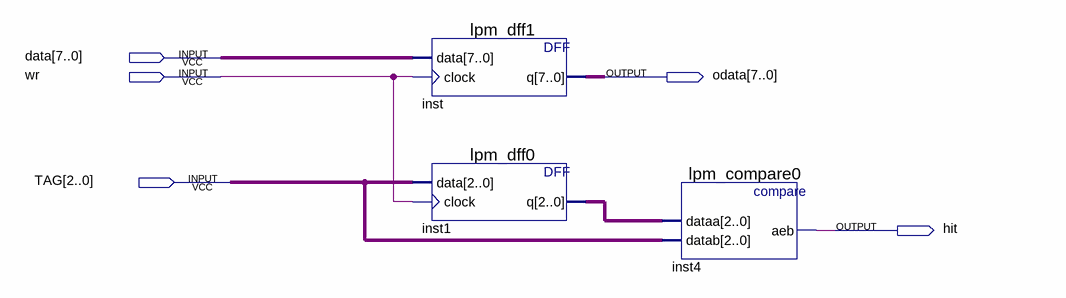
[diagram p0: schematic sheet]
// Quartus schematic cache_cell.bdf as structural Verilog: 3 symbols, 5 pins
module cache_cell (
  input  [7:0] data,
  input  wr,
  input  [2:0] TAG,
  output [7:0] odata,
  output hit
);

  wire [2:0] inst1_q;

  lpm_dff1 inst (.data(data), .clock(wr), .q(odata));
  lpm_dff0 inst1 (.data(TAG), .clock(wr), .q(inst1_q));
  lpm_compare0 inst4 (.dataa(inst1_q), .datab(TAG), .aeb(hit));
endmodule
